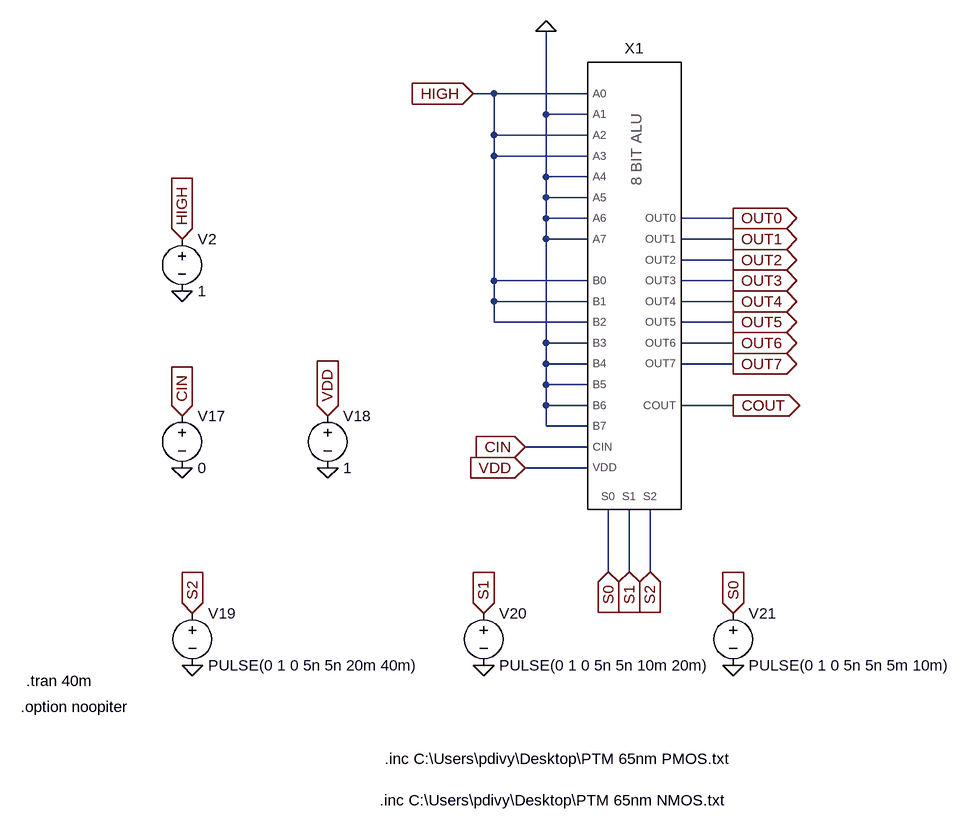
[diagram p0: schematic Draft1.asc]
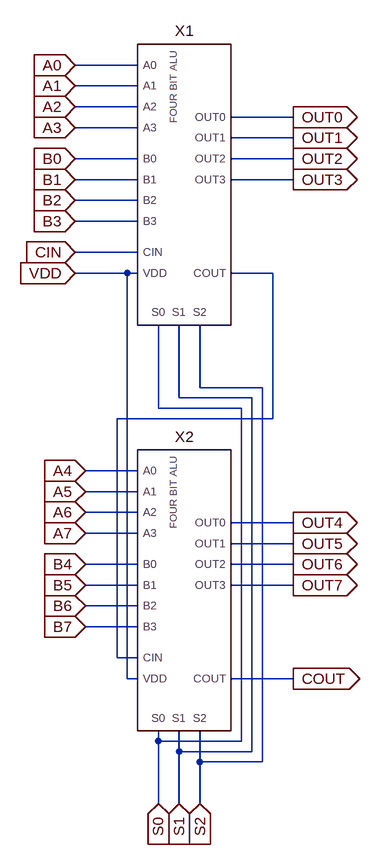
[diagram p1: sub-circuit eightbitalu_v2.asc]
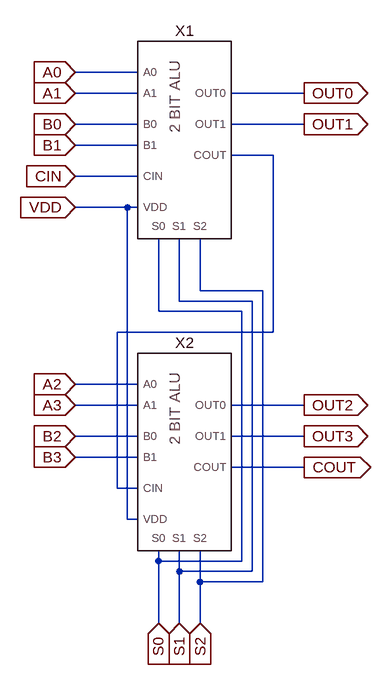
[diagram p2: sub-circuit fourbitalu.asc]
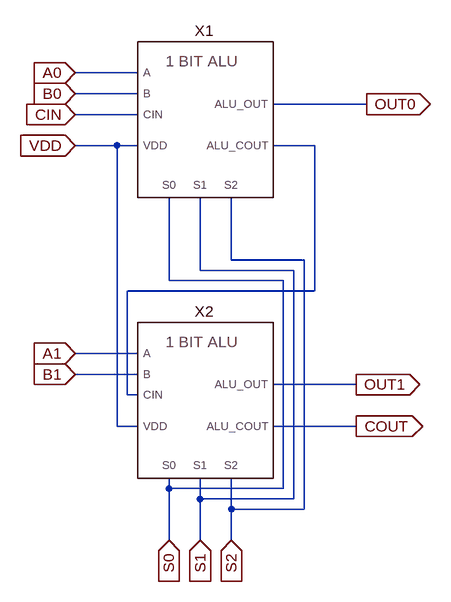
[diagram p3: sub-circuit twobitalu.asc]
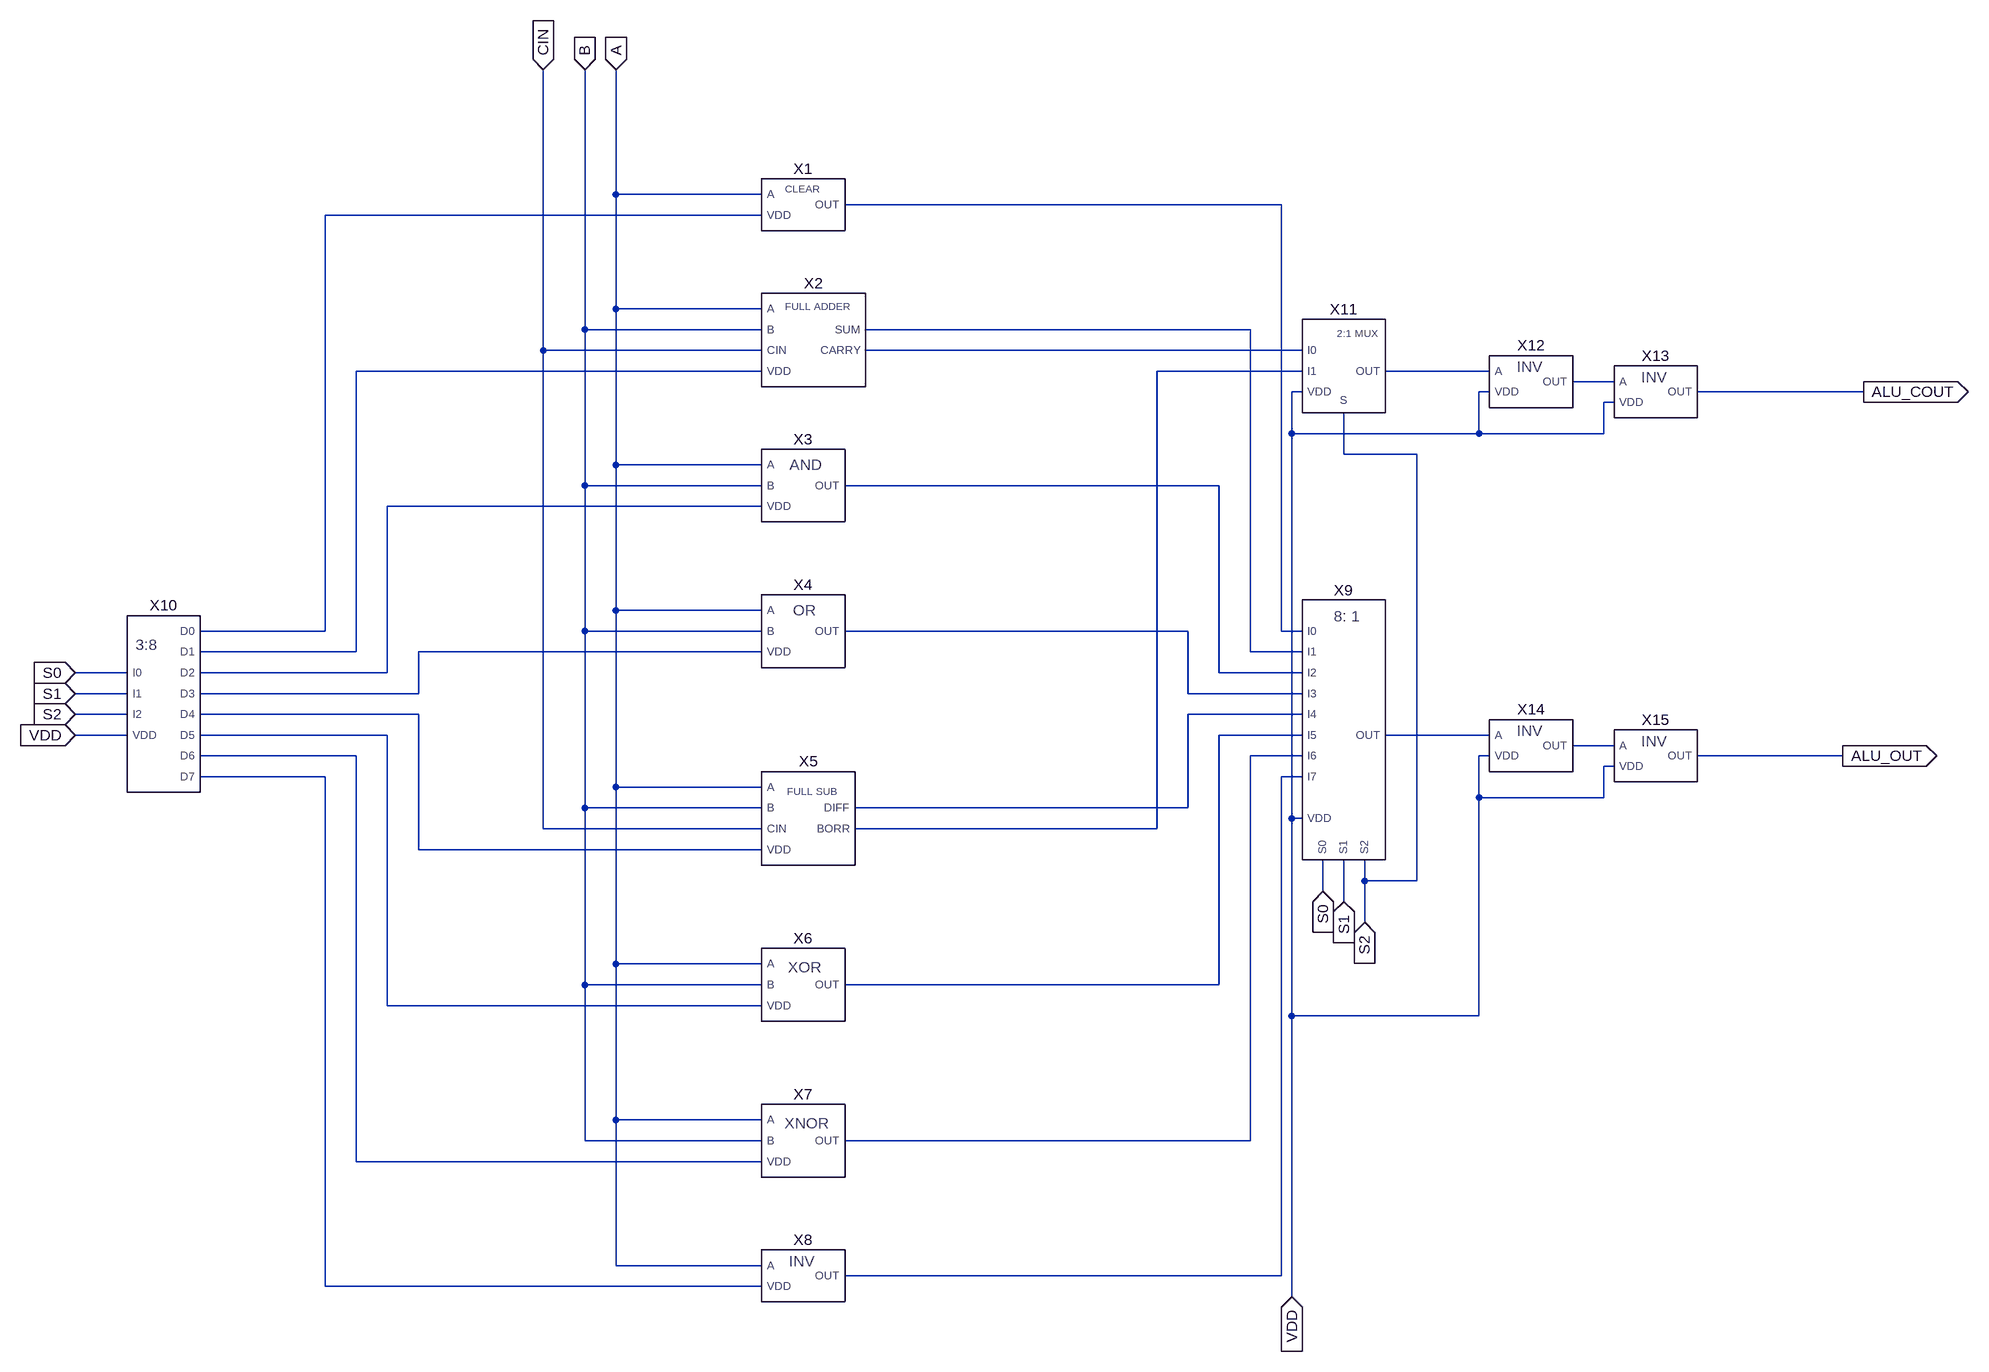
[diagram p4: sub-circuit onebitalu.asc]
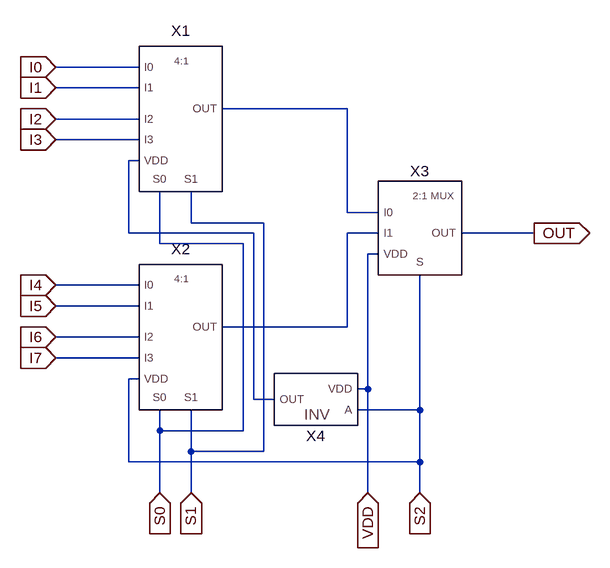
[diagram p5: sub-circuit mux8to1.asc]
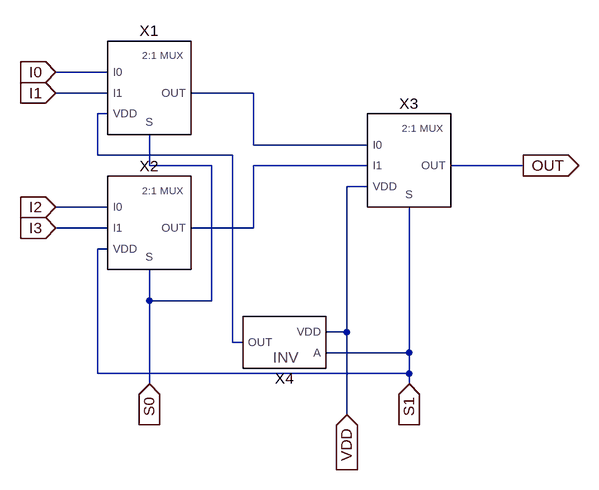
[diagram p6: sub-circuit mux4to1.asc]
Draft1.asc, the LTspice schematic file:
Version 4
SHEET 1 880 4776
WIRE -48 -144 -80 -144
WIRE 96 -144 -48 -144
WIRE 32 -112 32 -240
WIRE 96 -112 32 -112
WIRE -48 -80 -48 -144
WIRE 96 -80 -48 -80
WIRE -48 -48 -48 -80
WIRE 96 -48 -48 -48
WIRE 32 -16 32 -112
WIRE 96 -16 32 -16
WIRE 32 16 32 -16
WIRE 96 16 32 16
WIRE 32 48 32 16
WIRE 96 48 32 48
WIRE 320 48 240 48
WIRE 32 80 32 48
WIRE 96 80 32 80
WIRE 320 80 240 80
WIRE 320 112 240 112
WIRE -48 144 -48 -48
WIRE 96 144 -48 144
WIRE 320 144 240 144
WIRE -48 176 -48 144
WIRE 96 176 -48 176
WIRE 320 176 240 176
WIRE -48 208 -48 176
WIRE 96 208 -48 208
WIRE 320 208 240 208
WIRE 32 240 32 80
WIRE 96 240 32 240
WIRE 320 240 240 240
WIRE 32 272 32 240
WIRE 96 272 32 272
WIRE 320 272 240 272
WIRE 32 304 32 272
WIRE 96 304 32 304
WIRE 32 336 32 304
WIRE 96 336 32 336
WIRE 320 336 240 336
WIRE 32 368 32 336
WIRE 96 368 32 368
WIRE 96 400 0 400
WIRE 96 432 0 432
WIRE 128 592 128 496
WIRE 160 592 160 496
WIRE 192 592 192 496
FLAG 0 400 CIN
IOPIN 0 400 In
FLAG 0 432 VDD
IOPIN 0 432 In
FLAG 320 48 OUT0
IOPIN 320 48 Out
FLAG 320 80 OUT1
IOPIN 320 80 Out
FLAG 320 112 OUT2
IOPIN 320 112 Out
FLAG 320 144 OUT3
IOPIN 320 144 Out
FLAG 320 176 OUT4
IOPIN 320 176 Out
FLAG 320 208 OUT5
IOPIN 320 208 Out
FLAG 320 240 OUT6
IOPIN 320 240 Out
FLAG 320 272 OUT7
IOPIN 320 272 Out
FLAG 320 336 COUT
IOPIN 320 336 Out
FLAG 192 592 S2
IOPIN 192 592 In
FLAG 160 592 S1
IOPIN 160 592 In
FLAG 128 592 S0
IOPIN 128 592 In
FLAG -528 160 0
FLAG -528 80 HIGH
IOPIN -528 80 In
FLAG -304 432 0
FLAG -528 432 0
FLAG -528 352 CIN
IOPIN -528 352 In
FLAG -304 352 VDD
IOPIN -304 352 In
FLAG -512 736 0
FLAG -64 736 0
FLAG 320 736 0
FLAG -512 656 S2
IOPIN -512 656 In
FLAG -64 656 S1
IOPIN -64 656 In
FLAG 320 656 S0
IOPIN 320 656 In
FLAG -80 -144 HIGH
IOPIN -80 -144 In
FLAG 32 -240 0
SYMBOL EightBITALU_V2 160 160 R0
SYMATTR InstName X1
SYMBOL voltage -528 64 R0
WINDOW 123 0 0 Left 0
WINDOW 39 0 0 Left 0
SYMATTR InstName V2
SYMATTR Value 1
SYMBOL voltage -528 336 R0
WINDOW 123 0 0 Left 0
WINDOW 39 0 0 Left 0
SYMATTR InstName V17
SYMATTR Value 0
SYMBOL voltage -304 336 R0
WINDOW 123 0 0 Left 0
WINDOW 39 0 0 Left 0
SYMATTR InstName V18
SYMATTR Value 1
SYMBOL voltage -512 640 R0
WINDOW 123 0 0 Left 0
WINDOW 39 0 0 Left 0
SYMATTR InstName V19
SYMATTR Value PULSE(0 1 0 5n 5n 20m 40m)
SYMBOL voltage -64 640 R0
WINDOW 123 0 0 Left 0
WINDOW 39 0 0 Left 0
SYMATTR InstName V20
SYMATTR Value PULSE(0 1 0 5n 5n 10m 20m)
SYMBOL voltage 320 640 R0
WINDOW 123 0 0 Left 0
WINDOW 39 0 0 Left 0
SYMATTR InstName V21
SYMATTR Value PULSE(0 1 0 5n 5n 5m 10m)
TEXT -768 760 Left 2 !.tran 40m
TEXT -776 800 Left 2 !.option noopiter
TEXT -216 880 Left 2 !.inc C:\\Users\\pdivy\\Desktop\\PTM 65nm PMOS.txt
TEXT -224 944 Left 2 !.inc C:\\Users\\pdivy\\Desktop\\PTM 65nm NMOS.txt

eightbitalu_v2.asc, the sub-circuit schematic file:
Version 4
SHEET 1 880 1144
WIRE 112 -80 16 -80
WIRE 112 -48 16 -48
WIRE 112 -16 16 -16
WIRE 352 0 256 0
WIRE 112 16 16 16
WIRE 352 32 256 32
WIRE 112 64 16 64
WIRE 352 64 256 64
WIRE 112 96 16 96
WIRE 352 96 256 96
WIRE 112 128 16 128
WIRE 112 160 16 160
WIRE 112 208 16 208
WIRE 96 240 16 240
WIRE 112 240 96 240
WIRE 320 240 256 240
WIRE 208 416 208 320
WIRE 304 416 208 416
WIRE 176 432 176 320
WIRE 288 432 176 432
WIRE 144 448 144 320
WIRE 272 448 144 448
WIRE 320 464 320 240
WIRE 320 464 80 464
WIRE 112 544 32 544
WIRE 112 576 32 576
WIRE 112 608 32 608
WIRE 352 624 256 624
WIRE 112 640 32 640
WIRE 352 656 256 656
WIRE 112 688 32 688
WIRE 352 688 256 688
WIRE 112 720 32 720
WIRE 352 720 256 720
WIRE 112 752 32 752
WIRE 112 784 32 784
WIRE 80 832 80 464
WIRE 112 832 80 832
WIRE 96 864 96 240
WIRE 112 864 96 864
WIRE 352 864 256 864
WIRE 144 960 144 944
WIRE 272 960 272 448
WIRE 272 960 144 960
WIRE 176 976 176 944
WIRE 288 976 288 432
WIRE 288 976 176 976
WIRE 208 992 208 944
WIRE 304 992 304 416
WIRE 304 992 208 992
WIRE 144 1056 144 960
WIRE 176 1056 176 976
WIRE 208 1056 208 992
FLAG 16 -80 A0
IOPIN 16 -80 In
FLAG 16 -48 A1
IOPIN 16 -48 In
FLAG 16 -16 A2
IOPIN 16 -16 In
FLAG 16 16 A3
IOPIN 16 16 In
FLAG 16 64 B0
IOPIN 16 64 In
FLAG 16 96 B1
IOPIN 16 96 In
FLAG 16 128 B2
IOPIN 16 128 In
FLAG 16 160 B3
IOPIN 16 160 In
FLAG 16 208 CIN
IOPIN 16 208 In
FLAG 16 240 VDD
IOPIN 16 240 In
FLAG 32 544 A4
IOPIN 32 544 In
FLAG 32 576 A5
IOPIN 32 576 In
FLAG 32 608 A6
IOPIN 32 608 In
FLAG 32 640 A7
IOPIN 32 640 In
FLAG 32 688 B4
IOPIN 32 688 In
FLAG 32 720 B5
IOPIN 32 720 In
FLAG 32 752 B6
IOPIN 32 752 In
FLAG 32 784 B7
IOPIN 32 784 In
FLAG 208 1056 S2
IOPIN 208 1056 In
FLAG 176 1056 S1
IOPIN 176 1056 In
FLAG 144 1056 S0
IOPIN 144 1056 In
FLAG 352 0 OUT0
IOPIN 352 0 Out
FLAG 352 32 OUT1
IOPIN 352 32 Out
FLAG 352 64 OUT2
IOPIN 352 64 Out
FLAG 352 96 OUT3
IOPIN 352 96 Out
FLAG 352 624 OUT4
IOPIN 352 624 Out
FLAG 352 656 OUT5
IOPIN 352 656 Out
FLAG 352 688 OUT6
IOPIN 352 688 Out
FLAG 352 720 OUT7
IOPIN 352 720 Out
FLAG 352 864 COUT
IOPIN 352 864 Out
SYMBOL FourBitALU 176 112 R0
SYMATTR InstName X1
SYMBOL FourBitALU 176 736 R0
SYMATTR InstName X2

fourbitalu.asc, the sub-circuit schematic file:
Version 4
SHEET 1 880 744
WIRE 144 -192 48 -192
WIRE 144 -160 48 -160
WIRE 400 -160 288 -160
WIRE 144 -112 48 -112
WIRE 400 -112 288 -112
WIRE 144 -80 48 -80
WIRE 352 -64 288 -64
WIRE 144 -32 48 -32
WIRE 128 16 48 16
WIRE 144 16 128 16
WIRE 240 144 240 64
WIRE 336 144 240 144
WIRE 208 160 208 64
WIRE 320 160 208 160
WIRE 176 176 176 64
WIRE 304 176 176 176
WIRE 352 208 352 -64
WIRE 352 208 112 208
WIRE 144 288 48 288
WIRE 144 320 48 320
WIRE 400 320 288 320
WIRE 144 368 48 368
WIRE 400 368 288 368
WIRE 144 400 48 400
WIRE 400 416 288 416
WIRE 112 448 112 208
WIRE 144 448 112 448
WIRE 128 496 128 16
WIRE 144 496 128 496
WIRE 176 560 176 544
WIRE 304 560 304 176
WIRE 304 560 176 560
WIRE 208 576 208 544
WIRE 320 576 320 160
WIRE 320 576 208 576
WIRE 240 592 240 544
WIRE 336 592 336 144
WIRE 336 592 240 592
WIRE 176 656 176 560
WIRE 208 656 208 576
WIRE 240 656 240 592
FLAG 48 -192 A0
IOPIN 48 -192 In
FLAG 48 -160 A1
IOPIN 48 -160 In
FLAG 48 -112 B0
IOPIN 48 -112 In
FLAG 48 -80 B1
IOPIN 48 -80 In
FLAG 48 -32 CIN
IOPIN 48 -32 In
FLAG 400 -160 OUT0
IOPIN 400 -160 Out
FLAG 400 -112 OUT1
IOPIN 400 -112 Out
FLAG 48 288 A2
IOPIN 48 288 In
FLAG 48 320 A3
IOPIN 48 320 In
FLAG 48 368 B2
IOPIN 48 368 In
FLAG 48 400 B3
IOPIN 48 400 In
FLAG 400 320 OUT2
IOPIN 400 320 Out
FLAG 400 368 OUT3
IOPIN 400 368 Out
FLAG 176 656 S0
IOPIN 176 656 In
FLAG 208 656 S1
IOPIN 208 656 In
FLAG 240 656 S2
IOPIN 240 656 In
FLAG 400 416 COUT
IOPIN 400 416 Out
FLAG 48 16 VDD
IOPIN 48 16 In
SYMBOL TwoBitALU 208 -80 R0
SYMATTR InstName X1
SYMBOL TwoBitALU 208 400 R0
SYMATTR InstName X2

twobitalu.asc, the sub-circuit schematic file:
Version 4
SHEET 1 880 872
WIRE 96 64 0 64
WIRE 96 96 0 96
WIRE 448 112 304 112
WIRE 96 128 0 128
WIRE 64 176 0 176
WIRE 96 176 64 176
WIRE 368 176 304 176
WIRE 240 352 240 256
WIRE 352 352 240 352
WIRE 192 368 192 256
WIRE 336 368 192 368
WIRE 144 384 144 256
WIRE 320 384 144 384
WIRE 368 400 368 176
WIRE 368 400 80 400
WIRE 96 496 0 496
WIRE 96 528 0 528
WIRE 432 544 304 544
WIRE 80 560 80 400
WIRE 96 560 80 560
WIRE 64 608 64 176
WIRE 96 608 64 608
WIRE 432 608 304 608
WIRE 144 704 144 688
WIRE 320 704 320 384
WIRE 320 704 144 704
WIRE 192 720 192 688
WIRE 336 720 336 368
WIRE 336 720 192 720
WIRE 240 736 240 688
WIRE 352 736 352 352
WIRE 352 736 240 736
WIRE 144 784 144 704
WIRE 192 784 192 720
WIRE 240 784 240 736
FLAG 0 64 A0
IOPIN 0 64 In
FLAG 0 96 B0
IOPIN 0 96 In
FLAG 0 128 CIN
IOPIN 0 128 In
FLAG 0 176 VDD
IOPIN 0 176 In
FLAG 448 112 OUT0
IOPIN 448 112 Out
FLAG 0 496 A1
IOPIN 0 496 In
FLAG 0 528 B1
IOPIN 0 528 In
FLAG 432 544 OUT1
IOPIN 432 544 Out
FLAG 432 608 COUT
IOPIN 432 608 Out
FLAG 144 784 S0
IOPIN 144 784 In
FLAG 192 784 S1
IOPIN 192 784 In
FLAG 240 784 S2
IOPIN 240 784 In
SYMBOL OneBitALU 192 144 R0
SYMATTR InstName X1
SYMBOL OneBitALU 192 576 R0
SYMATTR InstName X2

onebitalu.asc, the sub-circuit schematic file:
Version 4
SHEET 1 2344 1868
WIRE -96 64 -96 -128
WIRE 128 64 -96 64
WIRE 928 80 256 80
WIRE 128 96 -544 96
WIRE -96 240 -96 64
WIRE 128 240 -96 240
WIRE -144 272 -144 -128
WIRE 128 272 -144 272
WIRE 880 272 288 272
WIRE -208 304 -208 -128
WIRE 128 304 -208 304
WIRE 960 304 288 304
WIRE 128 336 -496 336
WIRE 960 336 736 336
WIRE 1248 336 1088 336
WIRE 1440 352 1376 352
WIRE 960 368 944 368
WIRE 1248 368 1232 368
WIRE 1824 368 1568 368
WIRE 1440 384 1424 384
WIRE 944 432 944 368
WIRE 1232 432 1232 368
WIRE 1232 432 944 432
WIRE 1424 432 1424 384
WIRE 1424 432 1232 432
WIRE 1024 464 1024 400
WIRE 1136 464 1024 464
WIRE -96 480 -96 240
WIRE 128 480 -96 480
WIRE -144 512 -144 272
WIRE 128 512 -144 512
WIRE 832 512 256 512
WIRE 128 544 -448 544
WIRE -96 704 -96 480
WIRE 128 704 -96 704
WIRE -544 736 -544 96
WIRE -544 736 -736 736
WIRE -144 736 -144 512
WIRE 128 736 -144 736
WIRE 784 736 256 736
WIRE 928 736 928 80
WIRE 960 736 928 736
WIRE -496 768 -496 336
WIRE -496 768 -736 768
WIRE 128 768 -400 768
WIRE 880 768 880 272
WIRE 960 768 880 768
WIRE -848 800 -928 800
WIRE -448 800 -448 544
WIRE -448 800 -736 800
WIRE 832 800 832 512
WIRE 960 800 832 800
WIRE -848 832 -928 832
WIRE -400 832 -400 768
WIRE -400 832 -736 832
WIRE 784 832 784 736
WIRE 960 832 784 832
WIRE -848 864 -928 864
WIRE -400 864 -736 864
WIRE 960 864 784 864
WIRE -848 896 -928 896
WIRE -448 896 -736 896
WIRE 960 896 832 896
WIRE 1248 896 1088 896
WIRE 1440 912 1376 912
WIRE -496 928 -736 928
WIRE 960 928 880 928
WIRE 1248 928 1232 928
WIRE 1792 928 1568 928
WIRE 1440 944 1424 944
WIRE -544 960 -736 960
WIRE 960 960 928 960
WIRE -96 976 -96 704
WIRE 128 976 -96 976
WIRE 1232 992 1232 928
WIRE 1424 992 1424 944
WIRE 1424 992 1232 992
WIRE -144 1008 -144 736
WIRE 128 1008 -144 1008
WIRE 784 1008 784 864
WIRE 784 1008 272 1008
WIRE 944 1024 944 432
WIRE 960 1024 944 1024
WIRE -208 1040 -208 304
WIRE 128 1040 -208 1040
WIRE 736 1040 736 336
WIRE 736 1040 272 1040
WIRE -400 1072 -400 864
WIRE 128 1072 -400 1072
WIRE 1056 1120 1056 1088
WIRE 1136 1120 1136 464
WIRE 1136 1120 1056 1120
WIRE 992 1136 992 1088
WIRE 1024 1152 1024 1088
WIRE 1056 1184 1056 1120
WIRE -96 1248 -96 976
WIRE 128 1248 -96 1248
WIRE -144 1280 -144 1008
WIRE 128 1280 -144 1280
WIRE 832 1280 832 896
WIRE 832 1280 256 1280
WIRE -448 1312 -448 896
WIRE 128 1312 -448 1312
WIRE 944 1328 944 1024
WIRE 1232 1328 1232 992
WIRE 1232 1328 944 1328
WIRE -96 1488 -96 1248
WIRE 128 1488 -96 1488
WIRE -144 1520 -144 1280
WIRE 128 1520 -144 1520
WIRE 880 1520 880 928
WIRE 880 1520 256 1520
WIRE -496 1552 -496 928
WIRE 128 1552 -496 1552
WIRE -96 1712 -96 1488
WIRE 128 1712 -96 1712
WIRE 928 1728 928 960
WIRE 928 1728 256 1728
WIRE -544 1744 -544 960
WIRE 128 1744 -544 1744
WIRE 944 1760 944 1328
FLAG -96 -128 A
IOPIN -96 -128 In
FLAG -144 -128 B
IOPIN -144 -128 In
FLAG -208 -128 CIN
IOPIN -208 -128 In
FLAG -928 800 S0
IOPIN -928 800 In
FLAG -928 832 S1
IOPIN -928 832 In
FLAG -928 864 S2
IOPIN -928 864 In
FLAG -928 896 VDD
IOPIN -928 896 In
FLAG 1056 1184 S2
IOPIN 1056 1184 In
FLAG 992 1136 S0
IOPIN 992 1136 In
FLAG 1024 1152 S1
IOPIN 1024 1152 In
FLAG 944 1760 VDD
IOPIN 944 1760 In
FLAG 1792 928 ALU_OUT
IOPIN 1792 928 Out
FLAG 1824 368 ALU_COUT
IOPIN 1824 368 Out
SYMBOL CLEAR 192 80 R0
SYMATTR InstName X1
SYMBOL FULLADDER 208 288 R0
SYMATTR InstName X2
SYMBOL ANDgdi 192 512 R0
SYMATTR InstName X3
SYMBOL ORgdi 192 736 R0
SYMATTR InstName X4
SYMBOL FULLSUB 192 1024 R0
SYMATTR InstName X5
SYMBOL XORgdi 192 1280 R0
SYMATTR InstName X6
SYMBOL XNORgdi 192 1520 R0
SYMATTR InstName X7
SYMBOL INVgdi 192 1728 R0
SYMATTR InstName X8
SYMBOL MUX8to1 1024 896 R0
SYMATTR InstName X9
SYMBOL Dec3to8 -800 848 R0
SYMATTR InstName X10
SYMBOL MUX2to1 1024 336 R0
SYMATTR InstName X11
SYMBOL INVgdi 1312 352 R0
SYMATTR InstName X12
SYMBOL INVgdi 1504 368 R0
SYMATTR InstName X13
SYMBOL INVgdi 1312 912 R0
SYMATTR InstName X14
SYMBOL INVgdi 1504 928 R0
SYMATTR InstName X15

mux8to1.asc, the sub-circuit schematic file:
Version 4
SHEET 1 880 812
WIRE 112 48 -16 48
WIRE 112 80 -16 80
WIRE 432 112 240 112
WIRE 112 128 -16 128
WIRE 112 160 -16 160
WIRE 112 192 96 192
WIRE 432 272 432 112
WIRE 480 272 432 272
WIRE 192 288 192 240
WIRE 304 288 192 288
WIRE 96 304 96 192
WIRE 288 304 96 304
WIRE 480 304 432 304
WIRE 720 304 608 304
WIRE 144 320 144 240
WIRE 272 320 144 320
WIRE 480 336 464 336
WIRE 112 384 -16 384
WIRE 112 416 -16 416
WIRE 432 448 432 304
WIRE 432 448 240 448
WIRE 112 464 -16 464
WIRE 112 496 -16 496
WIRE 112 528 96 528
WIRE 464 544 464 336
WIRE 464 544 448 544
WIRE 288 560 288 304
WIRE 320 560 288 560
WIRE 544 576 544 368
WIRE 544 576 448 576
WIRE 144 608 144 576
WIRE 272 608 272 320
WIRE 272 608 144 608
WIRE 192 640 192 576
WIRE 304 640 304 288
WIRE 304 640 192 640
WIRE 96 656 96 528
WIRE 544 656 544 576
WIRE 544 656 96 656
WIRE 144 704 144 608
WIRE 192 704 192 640
WIRE 464 704 464 544
WIRE 544 704 544 656
FLAG -16 48 I0
IOPIN -16 48 In
FLAG -16 80 I1
IOPIN -16 80 In
FLAG -16 128 I2
IOPIN -16 128 In
FLAG -16 160 I3
IOPIN -16 160 In
FLAG -16 384 I4
IOPIN -16 384 In
FLAG -16 416 I5
IOPIN -16 416 In
FLAG -16 464 I6
IOPIN -16 464 In
FLAG -16 496 I7
IOPIN -16 496 In
FLAG 144 704 S0
IOPIN 144 704 In
FLAG 192 704 S1
IOPIN 192 704 In
FLAG 544 704 S2
IOPIN 544 704 In
FLAG 464 704 VDD
IOPIN 464 704 In
FLAG 720 304 OUT
IOPIN 720 304 Out
SYMBOL MUX4to1 176 128 R0
SYMATTR InstName X1
SYMBOL MUX4to1 176 464 R0
SYMATTR InstName X2
SYMBOL MUX2to1 544 304 R0
SYMATTR InstName X3
SYMBOL INVgdi 384 560 R180
SYMATTR InstName X4

mux4to1.asc, the sub-circuit schematic file:
Version 4
SHEET 1 880 684
WIRE 96 48 16 48
WIRE 96 80 16 80
WIRE 320 80 224 80
WIRE 96 112 80 112
WIRE 320 160 320 80
WIRE 496 160 320 160
WIRE 80 176 80 112
WIRE 288 176 80 176
WIRE 160 192 160 144
WIRE 256 192 160 192
WIRE 496 192 320 192
WIRE 736 192 624 192
WIRE 496 224 464 224
WIRE 96 256 16 256
WIRE 96 288 16 288
WIRE 320 288 320 192
WIRE 320 288 224 288
WIRE 96 320 80 320
WIRE 160 400 160 352
WIRE 256 400 256 192
WIRE 256 400 160 400
WIRE 464 448 464 224
WIRE 464 448 432 448
WIRE 288 464 288 176
WIRE 304 464 288 464
WIRE 560 480 560 256
WIRE 560 480 432 480
WIRE 80 512 80 320
WIRE 560 512 560 480
WIRE 560 512 80 512
WIRE 160 528 160 400
WIRE 560 528 560 512
WIRE 464 576 464 448
FLAG 16 48 I0
IOPIN 16 48 In
FLAG 16 80 I1
IOPIN 16 80 In
FLAG 16 256 I2
IOPIN 16 256 In
FLAG 16 288 I3
IOPIN 16 288 In
FLAG 736 192 OUT
IOPIN 736 192 Out
FLAG 160 528 S0
IOPIN 160 528 In
FLAG 560 528 S1
IOPIN 560 528 In
FLAG 464 576 VDD
IOPIN 464 576 In
SYMBOL MUX2to1 160 80 R0
SYMATTR InstName X1
SYMBOL MUX2to1 160 288 R0
SYMATTR InstName X2
SYMBOL MUX2to1 560 192 R0
SYMATTR InstName X3
SYMBOL INVgdi 368 464 R180
SYMATTR InstName X4

The netlist it stands for:
* Draft1.asc
XX1 HIGH 0 HIGH HIGH 0 0 0 0 HIGH HIGH HIGH 0 0 0 0 0 CIN S0 S1 S2 VDD COUT OUT0 OUT1 OUT2 OUT3 OUT4 OUT5 OUT6 OUT7 eightbitalu_v2
V2 HIGH 0 1
V17 CIN 0 0
V18 VDD 0 1
V19 S2 0 PULSE(0 1 0 5n 5n 20m 40m)
V20 S1 0 PULSE(0 1 0 5n 5n 10m 20m)
V21 S0 0 PULSE(0 1 0 5n 5n 5m 10m)

* block symbol definitions
.subckt eightbitalu_v2 A0 A1 A2 A3 A4 A5 A6 A7 B0 B1 B2 B3 B4 B5 B6 B7 CIN S0 S1 S2 VDD COUT OUT0 OUT1 OUT2 OUT3 OUT4 OUT5 OUT6 OUT7
XX1 A0 A1 A2 A3 B0 B1 B2 B3 CIN S0 S1 S2 VDD N001 OUT0 OUT1 OUT2 OUT3 fourbitalu
XX2 A4 A5 A6 A7 B4 B5 B6 B7 N001 S0 S1 S2 VDD COUT OUT4 OUT5 OUT6 OUT7 fourbitalu
.ends eightbitalu_v2

.subckt fourbitalu A0 A1 A2 A3 B0 B1 B2 B3 CIN S0 S1 S2 VDD COUT OUT0 OUT1 OUT2 OUT3
XX1 A0 A1 B0 B1 CIN S0 S1 S2 VDD N001 OUT0 OUT1 twobitalu
XX2 A2 A3 B2 B3 N001 S0 S1 S2 VDD COUT OUT2 OUT3 twobitalu
.ends fourbitalu

.subckt twobitalu A0 A1 B0 B1 CIN S0 S1 S2 VDD COUT OUT0 OUT1
XX1 A0 B0 CIN S0 S1 S2 VDD N001 OUT0 onebitalu
XX2 A1 B1 N001 S0 S1 S2 VDD COUT OUT1 onebitalu
.ends twobitalu

.subckt onebitalu A B CIN S0 S1 S2 VDD ALU_COUT ALU_OUT
XX1 A N002 N001 CLEAR  ; pins A VDD OUT
XX2 A B CIN N005 N004 N003 FULLADDER  ; pins A B CIN VDD CARRY SUM
XX3 A B N010 N009 ANDgdi  ; pins A B VDD OUT
XX4 A B N012 N011 ORgdi  ; pins A B VDD OUT
XX5 A B CIN N013 N006 N014 FULLSUB  ; pins A B CIN VDD BORR DIFF
XX6 A B N015 N016 XORgdi  ; pins A B VDD OUT
XX7 A B N019 N020 XNORgdi  ; pins A B VDD OUT
XX8 A N021 N022 INVgdi  ; pins A VDD OUT
XX9 N001 N003 N009 N011 N014 N016 N020 N022 S0 S1 S2 VDD N017 mux8to1
XX10 S0 S1 S2 VDD N002 N005 N010 N012 N013 N015 N019 N021 Dec3to8  ; pins I0 I1 I2 VDD D0 D1 D2 D3 D4 D5 D6 D7
XX11 N004 N006 S2 VDD N007 MUX2to1  ; pins I0 I1 S VDD OUT
XX12 N007 VDD N008 INVgdi  ; pins A VDD OUT
XX13 N008 VDD ALU_COUT INVgdi  ; pins A VDD OUT
XX14 N017 VDD N018 INVgdi  ; pins A VDD OUT
XX15 N018 VDD ALU_OUT INVgdi  ; pins A VDD OUT
.ends onebitalu

.subckt mux8to1 I0 I1 I2 I3 I4 I5 I6 I7 S0 S1 S2 VDD OUT
XX1 I0 I1 I2 I3 S0 S1 N002 N001 mux4to1
XX2 I4 I5 I6 I7 S0 S1 S2 N003 mux4to1
XX3 N001 N003 S2 VDD OUT MUX2to1  ; pins I0 I1 S VDD OUT
XX4 S2 VDD N002 INVgdi  ; pins A VDD OUT
.ends mux8to1

.subckt mux4to1 I0 I1 I2 I3 S0 S1 VDD OUT
XX1 I0 I1 S0 N002 N001 MUX2to1  ; pins I0 I1 S VDD OUT
XX2 I2 I3 S0 S1 N003 MUX2to1  ; pins I0 I1 S VDD OUT
XX3 N001 N003 S1 VDD OUT MUX2to1  ; pins I0 I1 S VDD OUT
XX4 S1 VDD N002 INVgdi  ; pins A VDD OUT
.ends mux4to1

.tran 40m
.option noopiter
.inc C:\Users\pdivy\Desktop\PTM 65nm PMOS.txt
.inc C:\Users\pdivy\Desktop\PTM 65nm NMOS.txt
.backanno
.end

* Results of the author's LTspice run, read from the files saved beside the schematic
* Operating Point, zero values left out:
*   V(high) = 1 V
*   V(vdd) = 1 V
*   V(out0) = 14.8 µV
*   V(out1) = 14.66 µV
*   V(out2) = 14.95 µV
*   V(out3) = 14.72 µV
*   V(out4) = 14.46 µV
*   V(out5) = 14.46 µV
*   V(out6) = 14.46 µV
*   V(cout) = 14.45 µV
*   V(out7) = 14.46 µV
*   I(V2) = -98.25 µA
*   I(V17) = 113.9 pA
*   I(V18) = -47.61 µA
*   I(V19) = 17.86 µA
*   I(V20) = 8.327 µA
*   I(V21) = 2.444 nA
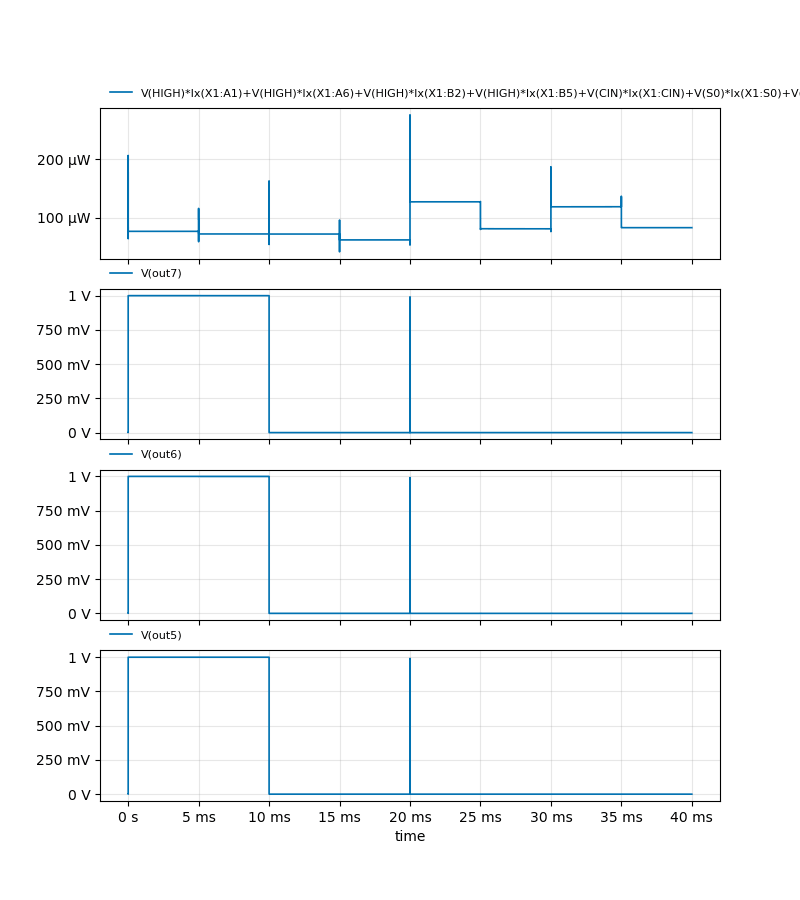
[diagram p7: Transient Analysis of Draft1.asc, plotted from the saved traces]
* Transient Analysis, 1 run:
*   V(HIGH)*Ix(X1:A1)+V(HIGH)*Ix(X1:A6)+V(HIGH)*Ix(X1:B2)+V(HIGH)*Ix(X1:B5)+V(CIN)*Ix(X1:CIN)+V(S0)*Ix(X1:S0)+V(S1)*Ix(X1:S1)+V(S2)*Ix(X1:S2)+V(VDD)*Ix(X1:VDD)+V(COUT)*Ix(X1:COUT)+V(OUT0)*Ix(X1:OUT0)+V(OUT1)*Ix(X1:OUT1)+V(OUT2)*Ix(X1:OUT2)+V(OUT3)*Ix(X1:OUT3)+V(OUT4)*Ix(X1:OUT4)+V(OUT5)*Ix(X1:OUT5)+V(OUT6)*Ix(X1:OUT6)+V(OUT7)*Ix(X1:OUT7): min 41.6 µW, max 276.1 µW, average 86.59 µW, rms 89.33 µW, last 82.93 µW
*   V(out7): min 6.475 µV, max 1 V, average 250 mV, rms 500 mV, last 14.46 µV
*   V(out6): min 6.475 µV, max 1 V, average 250 mV, rms 500 mV, last 14.46 µV
*   V(out5): min 6.475 µV, max 1 V, average 250 mV, rms 500 mV, last 14.46 µV